# Altium project Node MCU Power Shield.PrjPcb
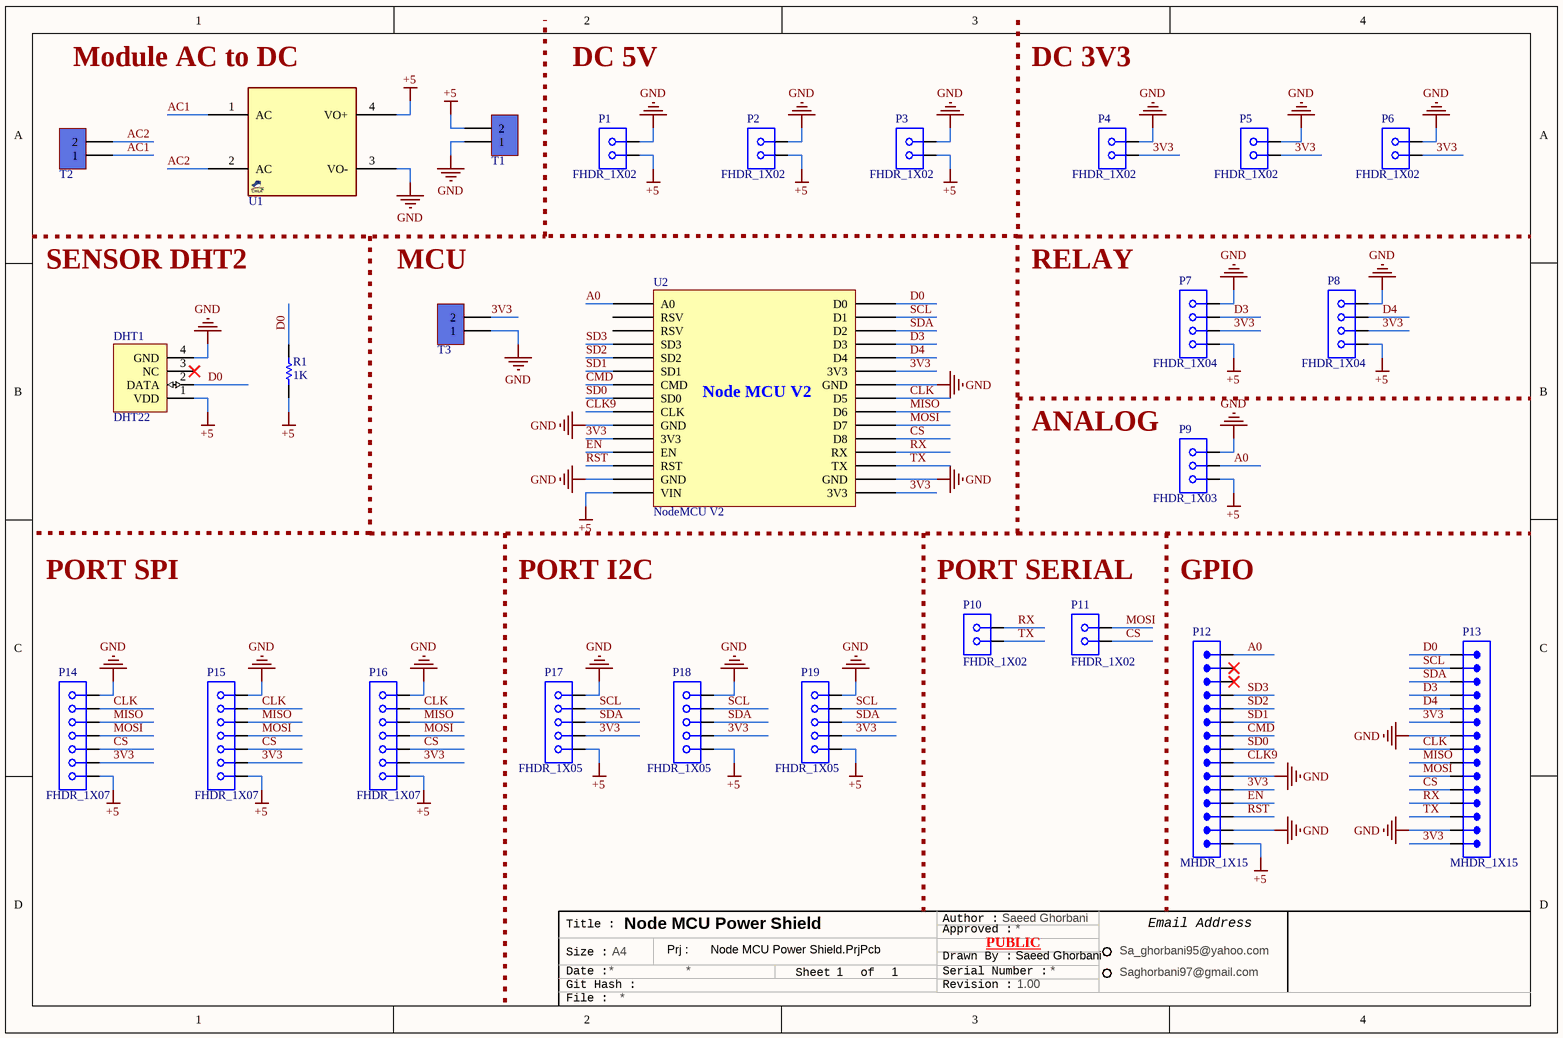
[diagram p0: Node MCU Power Shield.SchDoc]
1 sheet, 26 parts. Net scope: global (net labels, ports and power ports of the same name join across sheets).
Board file: Node MCU Power Shield.PcbDoc

## Sheet Node MCU Power Shield.SchDoc: Node MCU Power Shield
size A4; Author: Saeed Ghorbani; DrawnBy: Saeed Ghorbani; Revision: 1.00; SheetNumber: 1; SheetTotal: 1

### Parts
DHT1  DHT22  [DHT22_THD]
P1  FHDR_1X02  [FHDR1X02-254P]
P2  FHDR_1X02  [FHDR1X02-254P]
P3  FHDR_1X02  [FHDR1X02-254P]
P4  FHDR_1X02  [FHDR1X02-254P]
P5  FHDR_1X02  [FHDR1X02-254P]
P6  FHDR_1X02  [FHDR1X02-254P]
P7  FHDR_1X04  [FHDR1X04-254P]
P8  FHDR_1X04  [FHDR1X04-254P]
P9  FHDR_1X03  [FHDR1X03-254P]
P10  FHDR_1X02  [FHDR1X02-254P]
P11  FHDR_1X02  [FHDR1X02-254P]
P12  MHDR_1X15  [MHDR1X15-254P]
P13  MHDR_1X15  [MHDR1X15-254P]
P14  FHDR_1X07  [FHDR1X07-254P]
P15  FHDR_1X07  [FHDR1X07-254P]
P16  FHDR_1X07  [FHDR1X07-254P]
P17  FHDR_1X05  [FHDR1X05-254P]
P18  FHDR_1X05  [FHDR1X05-254P]
P19  FHDR_1X05  [FHDR1X05-254P]
R1  1K  [RES-(1/8)]
T1  KF301_Terminal  [KF301 2PIN]  (value not drawn)
T2  KF301_Terminal  [KF301 2PIN]  (value not drawn)
T3  KF301_Terminal  [KF301 2PIN]  (value not drawn)
U1  HLK-5M03  [HLK5M_4_38X23]  (value not drawn)
U2  NodeMCU V2  [NodeMCU V1.0 ESP-12E]

### Nets
+5: DHT1.1(VDD) P1.1 P2.1 P3.1 P7.1 P8.1 P9.1 P12.1 P14.1 P15.1 P16.1 P17.1 P18.1 P19.1 R1.1 T1.2 U1.4(VO+) U2.15(VIN)
GND: DHT1.4(GND) P1.2 P2.2 P3.2 P4.2 P5.2 P6.2 P7.4 P8.4 P9.3 P12.2 P12.6 P13.7 P13.14 P14.7 P15.7 P16.7 P17.5 P18.5 P19.5 T1.1 T3.1 U1.3(VO-) U2.10(GND) U2.14(GND) U2.17(GND) U2.24(GND)
3V3: P4.1 P5.1 P6.1 P7.2 P8.2 P12.5 P13.6 P13.15 P14.2 P15.2 P16.2 P17.2 P18.2 P19.2 T3.2 U2.11(3V3) U2.16(3V3) U2.25(3V3)
A0: P9.2 P12.15 U2.1(A0)
AC1: T2.1 U1.1(AC)
AC2: T2.2 U1.2(AC)
CLK: P13.8 P14.6 P15.6 P16.6 U2.23(D5)
CLK9: P12.7 U2.9(CLK)
CMD: P12.9 U2.7(CMD)
CS: P11.1 P13.11 P14.3 P15.3 P16.3 U2.20(D8)
D0: DHT1.2(DATA) P13.1 R1.2 U2.30(D0)
D3: P7.3 P13.4 U2.27(D3)
D4: P8.3 P13.5 U2.26(D4)
EN: P12.4 U2.12(EN)
MISO: P13.9 P14.5 P15.5 P16.5 U2.22(D6)
MOSI: P11.2 P13.10 P14.4 P15.4 P16.4 U2.21(D7)
RST: P12.3 U2.13(RST)
RX: P10.2 P13.12 U2.19(RX)
SCL: P13.2 P17.4 P18.4 P19.4 U2.29(D1)
SD0: P12.8 U2.8(SD0)
SD1: P12.10 U2.6(SD1)
SD2: P12.11 U2.5(SD2)
SD3: P12.12 U2.4(SD3)
SDA: P13.3 P17.3 P18.3 P19.3 U2.28(D2)
TX: P10.1 P13.13 U2.18(TX)

Not connected (* = marked no-connect by the designer): DHT1 3(NC)*; P12 13* 14*; U2 2(RSV) 3(RSV)

### Notes on the sheet
- (near U1) Module AC to DC
- DC 5V
- DC 3V3
- SENSOR DHT2
- (near T3) MCU
- RELAY
- ANALOG
- PORT SPI
- PORT I2C
- PORT SERIAL
- GPIO
- Title :
- Author :
- Email Address
- Size :
- Date :
- Git Hash :
- A4
- Prj :
- Sheet
- of
- Serial Number :
- Approved :
- Drawn By :
- Revision :
- PUBLIC
- Sa_ghorbani95@yahoo.com
- Saghorbani97@gmail.com
- File :
- (in symbol NodeMCU V2) Node MCU V2

### Library data of the parts
DHT1 = DHT22: Digital Humidity & Temprature Sensor
P1-P6 P10 P11 = FHDR_1X02: Female Header 1X02
P7 P8 = FHDR_1X04: Female Header 1X04
P9 = FHDR_1X03: Female Header 1X03
P12 P13 = MHDR_1X15: Male Header 1X15
P14-P16 = FHDR_1X07: Female Header 1X07
P17-P19 = FHDR_1X05: Female Header 1X05
R1 = RES DIP PACKAGE: TOTAL DIP RESISTOR PACK; Designer: Ali Hafizi
T1-T3 = KF301-2Pin_Terminal: Terminal 2 Pin 250VAC 16A; Part. No: KF301 2P; Designer: Abbas Basereh
U1 = HLK-5M03: AC/DC CONVERTER; MANF: HI-LINK; PARAM2: 3.3v, 5w; MANF_P#: HLK-5M03; VALUE: HLK-5M03